# EAGLE schematic SkinOS_Zara_v2 (EAGLE 7.5.0)

## Sheet 1 of 2
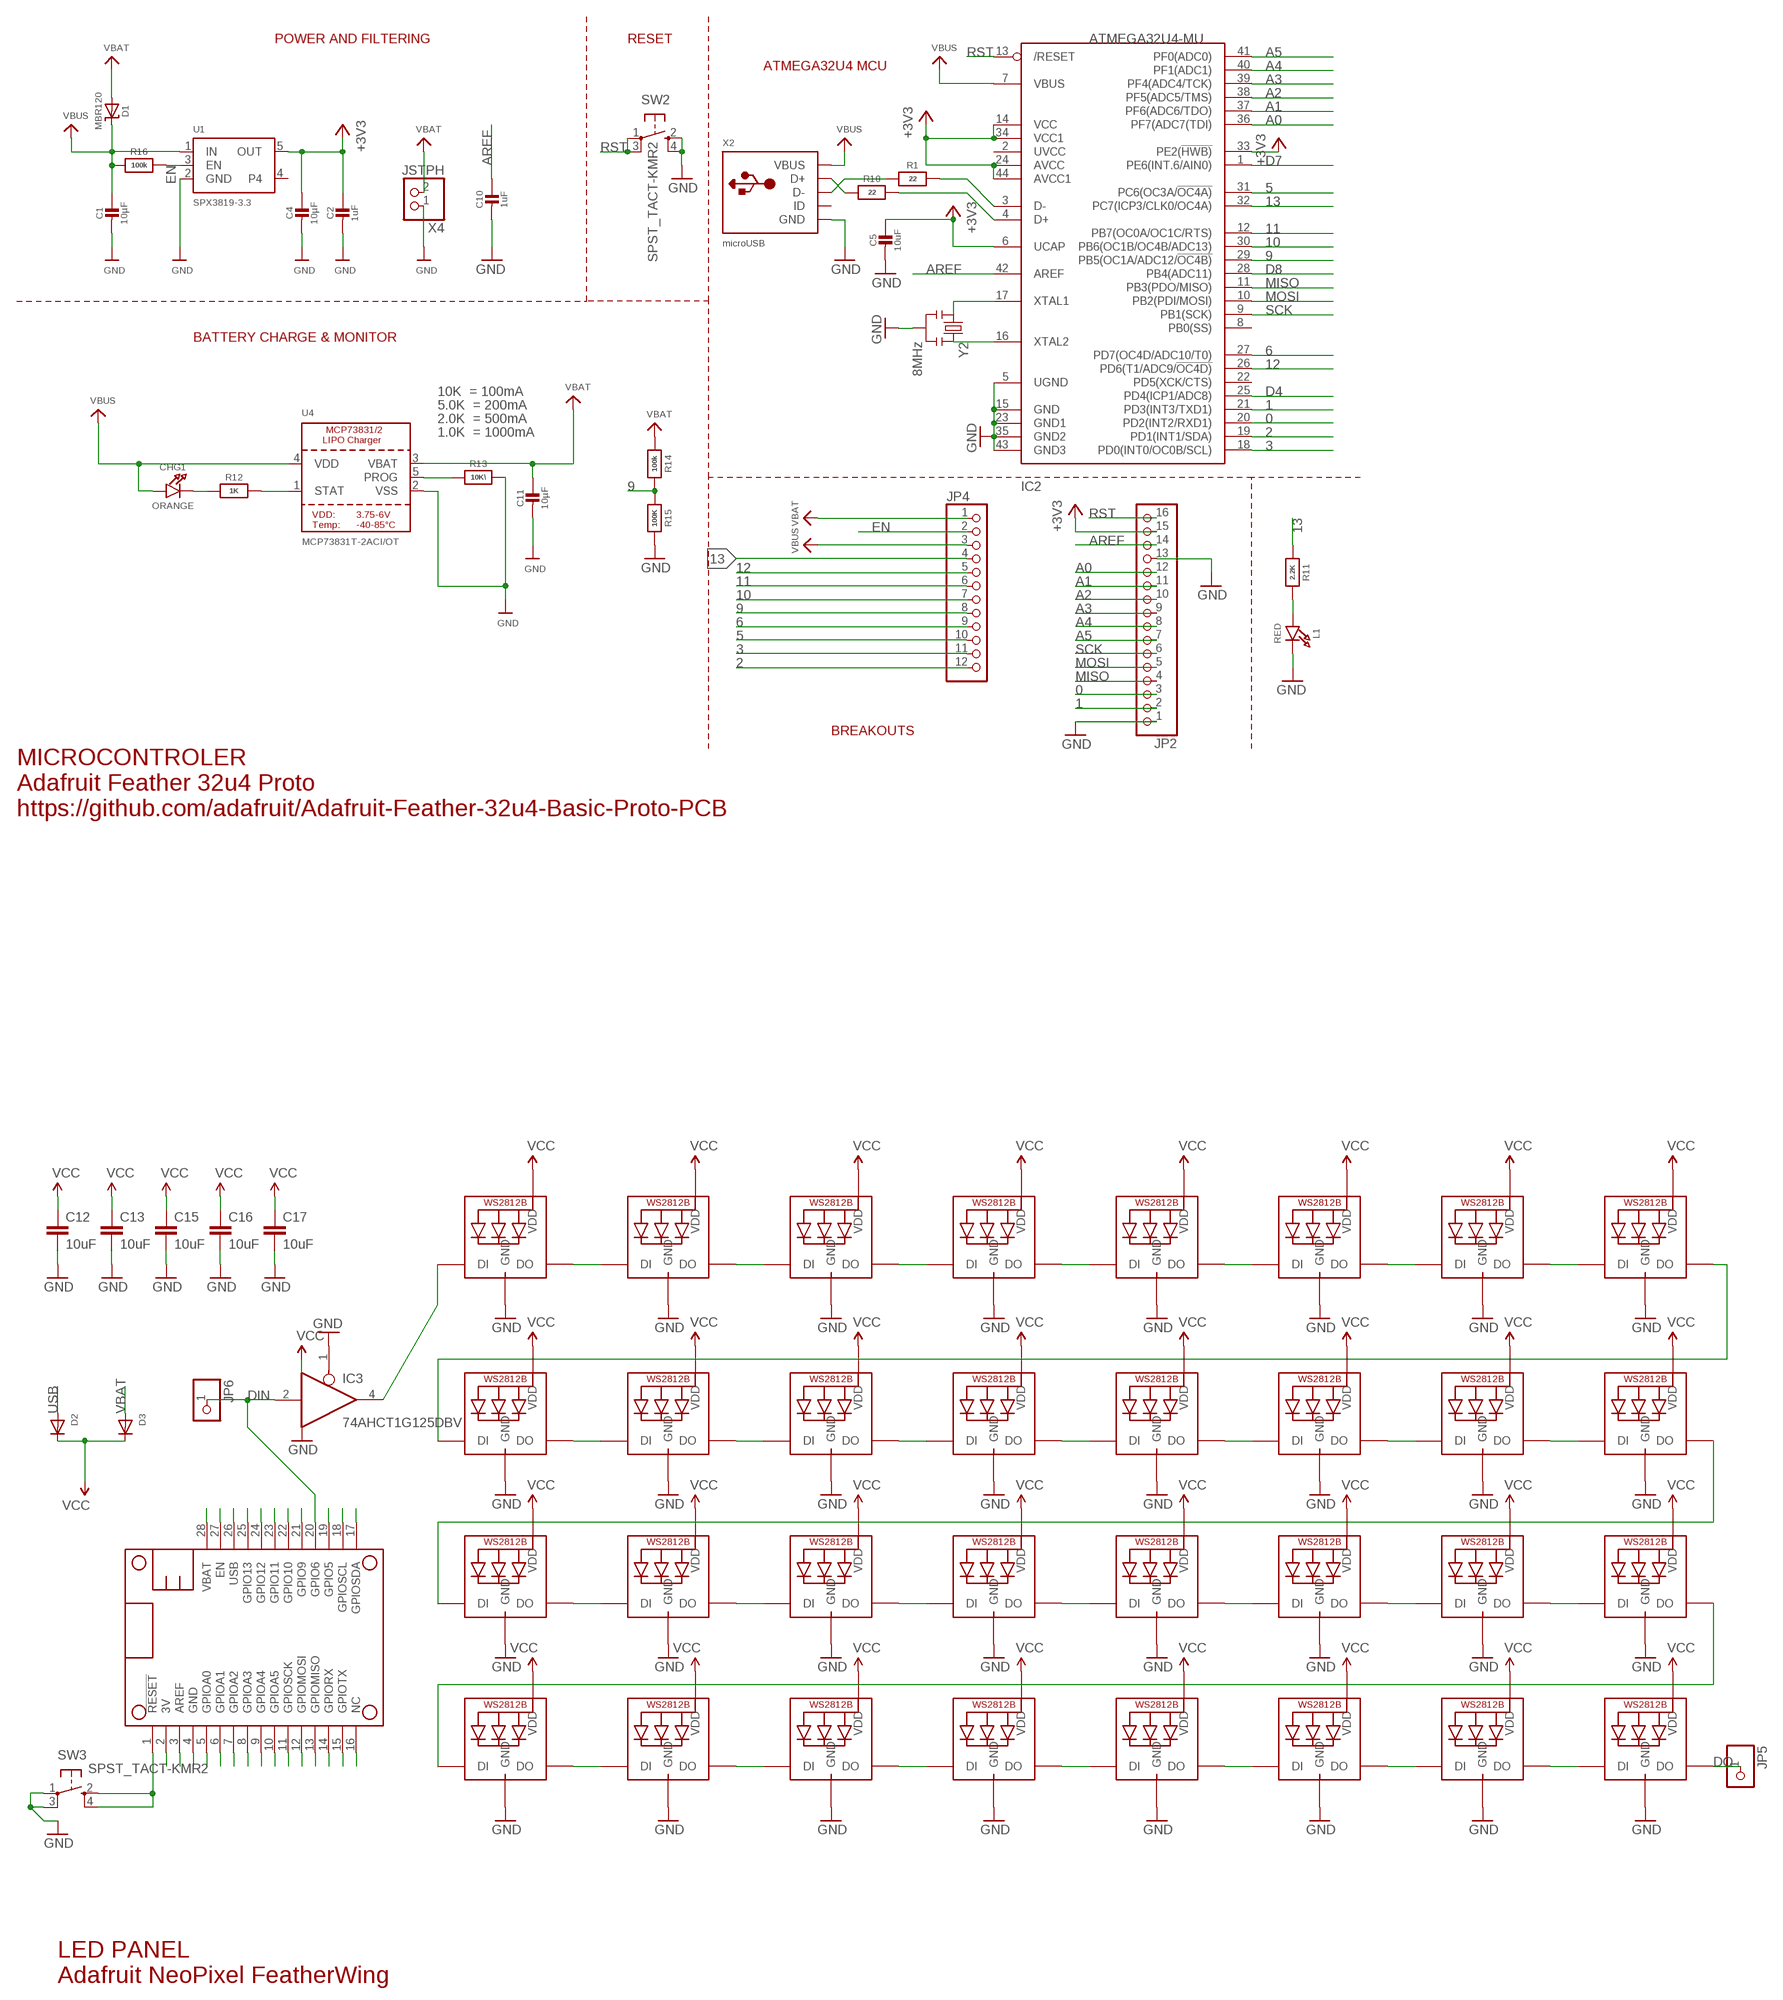
[diagram p0: schematic, sheet 1, part 1 of 2]
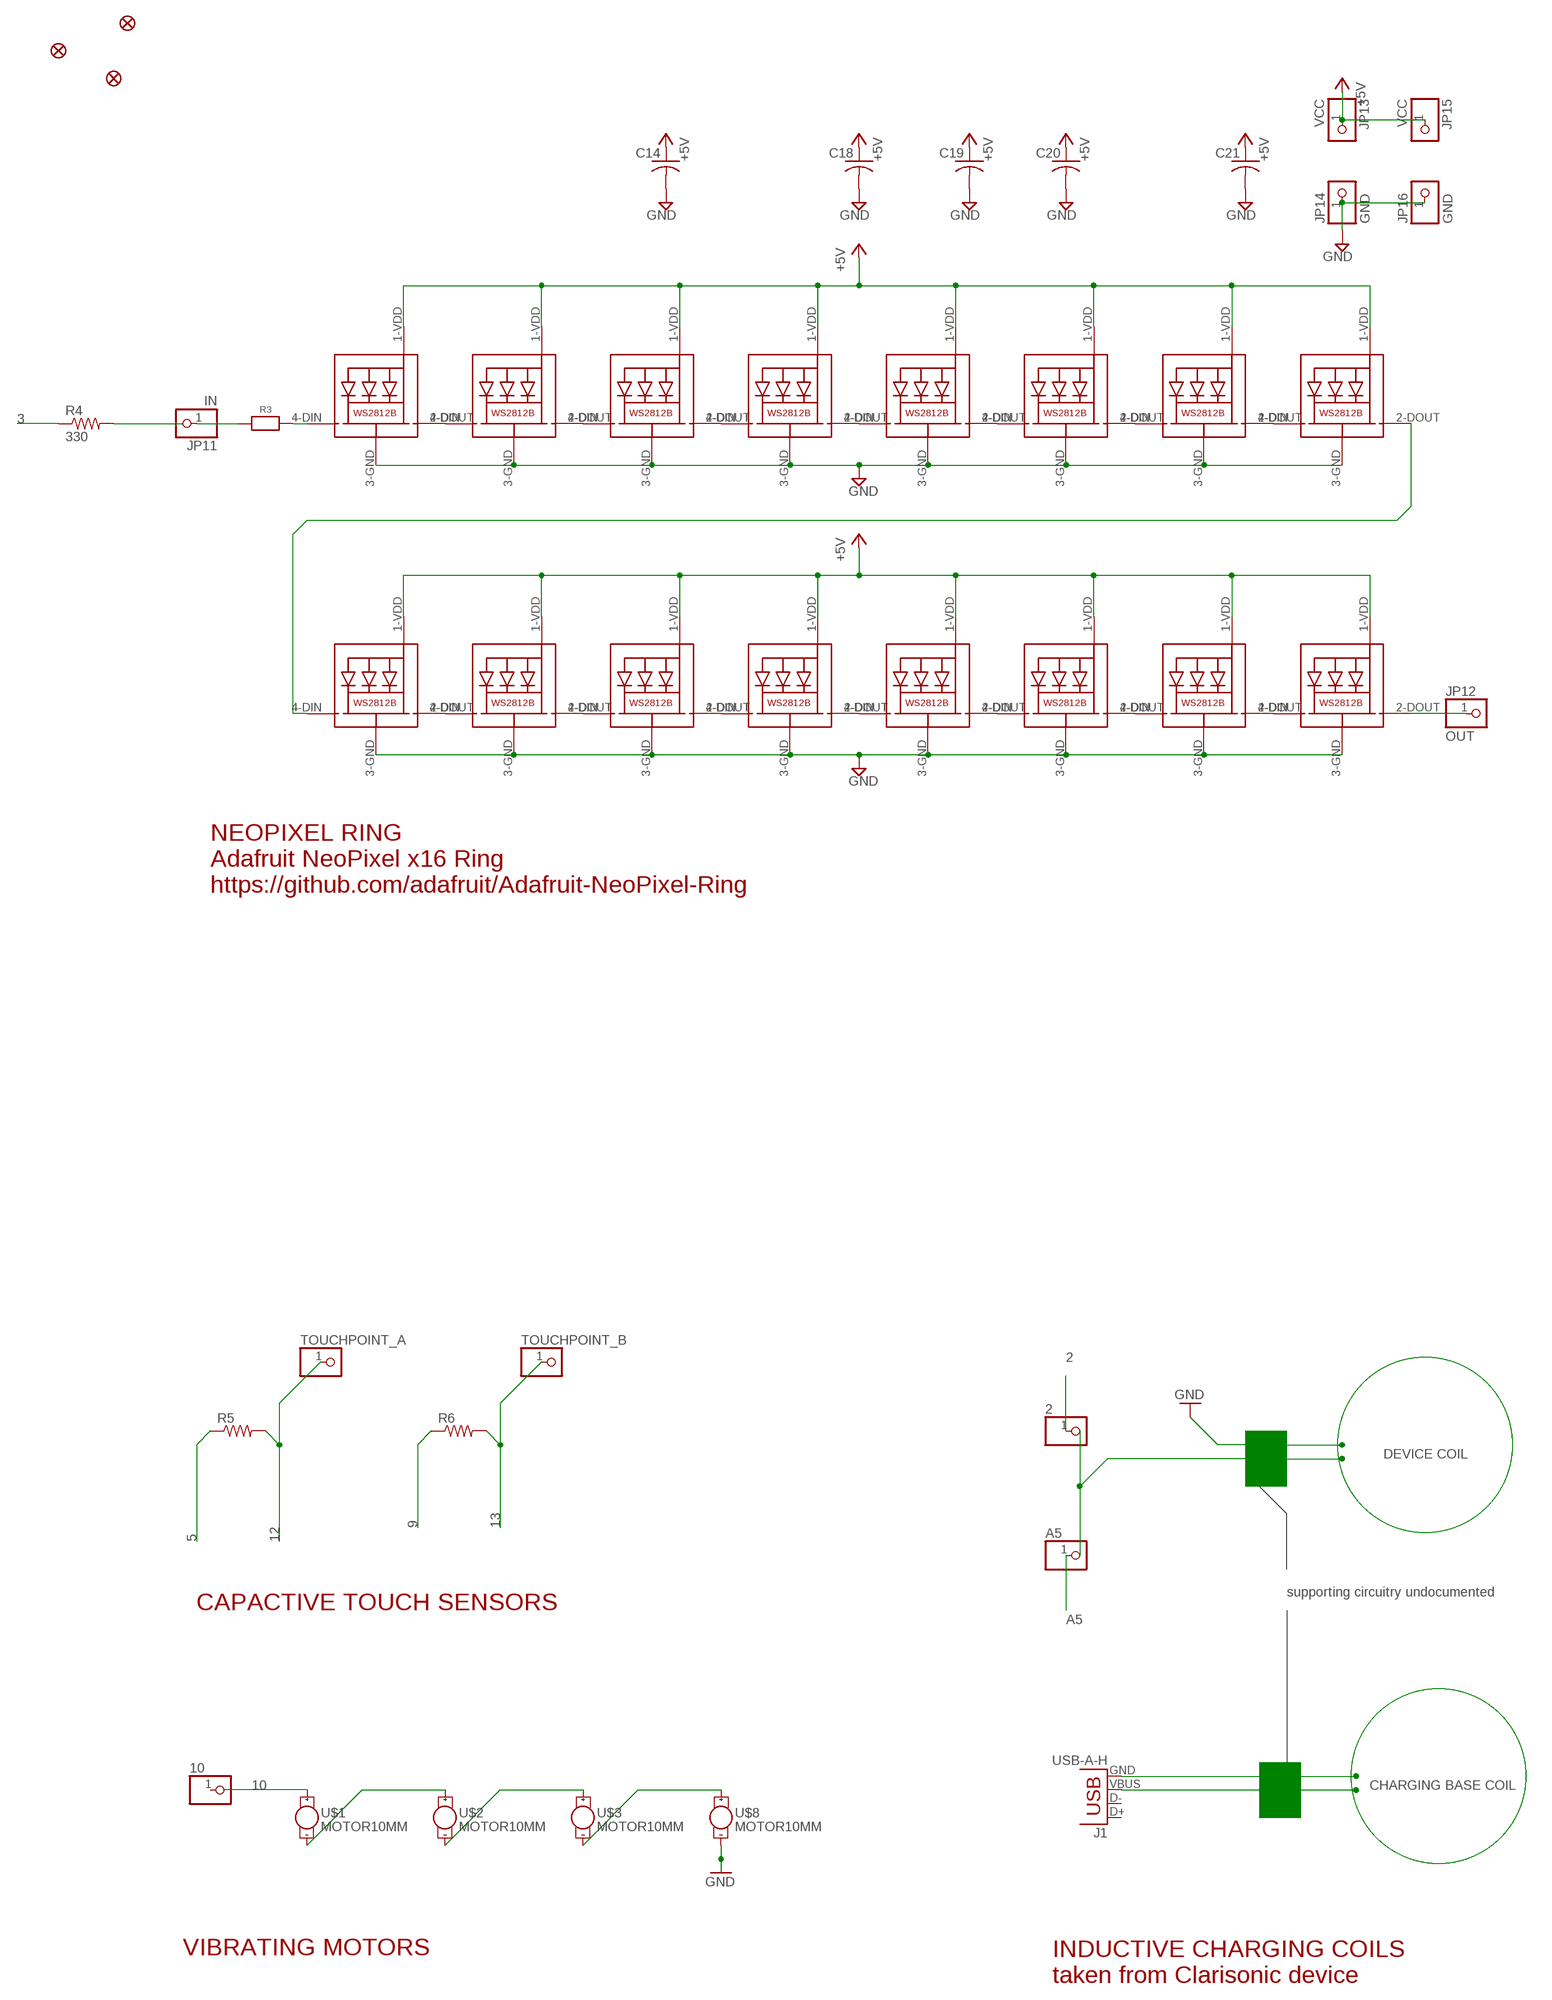
[diagram p1: schematic, sheet 1, part 2 of 2]

### Parts
2  PINHD-1X1  [1X01]
10  PINHD-1X1  [1X01]
A5  PINHD-1X1  [1X01]
C1  10µF  CAP_CERAMIC0805-NOOUTLINE  [0805-NO]
C2  1uF  CAP_CERAMIC0603_NO  [0603-NO]
C4  10µF  CAP_CERAMIC0805-NOOUTLINE  [0805-NO]
C5  10uF  CAP_CERAMIC0805-NOOUTLINE  [0805-NO]
C10  1uF  CAP_CERAMIC0603_NO  [0603-NO]
C11  10µF  CAP_CERAMIC0805-NOOUTLINE  [0805-NO]
C12  10uF  CAP0402-CAP  [0402-CAP]
C13  10uF  CAP0402-CAP  [0402-CAP]
C14  C-USC0603K  [C0603K]
C15  10uF  CAP0402-CAP  [0402-CAP]
C16  10uF  CAP0402-CAP  [0402-CAP]
C17  10uF  CAP0402-CAP  [0402-CAP]
C18  C-USC0603K  [C0603K]
C19  C-USC0603K  [C0603K]
C20  C-USC0603K  [C0603K]
C21  C-USC0603K  [C0603K]
CHG1  ORANGE  LED0805_NOOUTLINE  [CHIPLED_0805_NOOUTLINE]
D1  MBR120  DIODE-SCHOTTKYSOD-123  [SOD-123]
D2  DIODE_SOD-123FL  [SOD-123FL]
D3  DIODE_SOD-123FL  [SOD-123FL]
FID4  FIDUCIAL""  [FIDUCIAL_1MM]
FID5  FIDUCIAL""  [FIDUCIAL_1MM]
FID6  FIDUCIAL""  [FIDUCIAL_1MM]
IC2  ATMEGA32U4-MU  [TQFN44_7MM]
IC3  74AHCT1G125DBV  [SOT23-5]
J1  USB-A-H  [USB-A-H]
JP2  HEADER-1X16ROUND  [1X16_ROUND]
JP4  HEADER-1X12  [1X12_ROUND]
JP5  PINHD-1X1  [1X01]
JP6  PINHD-1X1  [1X01]
JP11  IN  PINHD-1X1CB  [1X01-CLEANBIG]
JP12  OUT  PINHD-1X1CB  [1X01-CLEANBIG]
JP13  VCC  PINHD-1X1CB  [1X01-CLEANBIG]
JP14  GND  PINHD-1X1CB  [1X01-CLEANBIG]
JP15  VCC  PINHD-1X1CB  [1X01-CLEANBIG]
JP16  GND  PINHD-1X1CB  [1X01-CLEANBIG]
L1  RED  LED0805_NOOUTLINE  [CHIPLED_0805_NOOUTLINE]
LED1  WS2812B3535  [LED3535]
LED2  WS2812B3535  [LED3535]
LED3  WS2812B3535  [LED3535]
LED4  WS2812B3535  [LED3535]
LED5  WS2812B3535  [LED3535]
LED6  WS2812B3535  [LED3535]
LED7  WS2812B3535  [LED3535]
LED8  WS2812B3535  [LED3535]
LED9  WS2812B3535  [LED3535]
LED10  WS2812B3535  [LED3535]
LED11  WS2812B3535  [LED3535]
LED12  WS2812B3535  [LED3535]
LED13  WS2812B3535  [LED3535]
LED14  WS2812B3535  [LED3535]
LED15  WS2812B3535  [LED3535]
LED16  WS2812B3535  [LED3535]
LED17  WS2812B3535  [LED3535]
LED18  WS2812B3535  [LED3535]
LED19  WS2812B3535  [LED3535]
LED20  WS2812B3535  [LED3535]
LED21  WS2812B3535  [LED3535]
LED22  WS2812B3535  [LED3535]
LED23  WS2812B3535  [LED3535]
LED24  WS2812B3535  [LED3535]
LED25  WS2812B3535  [LED3535]
LED26  WS2812B3535  [LED3535]
LED27  WS2812B3535  [LED3535]
LED28  WS2812B3535  [LED3535]
LED29  WS2812B3535  [LED3535]
LED30  WS2812B3535  [LED3535]
LED31  WS2812B3535  [LED3535]
LED32  WS2812B3535  [LED3535]
LED49  WS2812B5050  [WS2812B]
LED50  WS2812B5050  [WS2812B]
LED51  WS2812B5050  [WS2812B]
LED52  WS2812B5050  [WS2812B]
LED53  WS2812B5050  [WS2812B]
LED54  WS2812B5050  [WS2812B]
LED55  WS2812B5050  [WS2812B]
LED56  WS2812B5050  [WS2812B]
LED57  WS2812B5050  [WS2812B]
LED58  WS2812B5050  [WS2812B]
LED59  WS2812B5050  [WS2812B]
LED60  WS2812B5050  [WS2812B]
LED61  WS2812B5050  [WS2812B]
LED62  WS2812B5050  [WS2812B]
LED63  WS2812B5050  [WS2812B]
LED64  WS2812B5050  [WS2812B]
MS1  FEATHERWING  [FEATHERWING]
R1  22  RESISTOR_0603_NOOUT  [0603-NO]
R3  RESISTOR_0603_NOOUT  [0603-NO]
R4  330  RESISTOREZ  [AXIAL-0.3EZ]
R5  RESISTOREZ  [AXIAL-0.3EZ]
R6  RESISTOREZ  [AXIAL-0.3EZ]
R10  22  RESISTOR_0603_NOOUT  [0603-NO]
R11  2.2K  RESISTOR_0603_NOOUT  [0603-NO]
R12  1K  RESISTOR_0603_NOOUT  [0603-NO]
R13  10K\  RESISTOR_0603_NOOUT  [0603-NO]
R14  100k  RESISTOR_0603_NOOUT  [0603-NO]
R15  100K  RESISTOR_0603MP  [_0603MP]
R16  100k  RESISTOR_0603_NOOUT  [0603-NO]
SW2  SPST_TACT-KMR2  [KMR2]
SW3  SPST_TACT-KMR2  [KMR2]
TOUCHPOINT_A  PINHD-1X1  [1X01]
TOUCHPOINT_B  PINHD-1X1  [1X01]
U1  SPX3819-3.3  VREG_SOT23-5  [SOT23-5]
U4  MCP73831T-2ACI/OT  MCP73831/2  [SOT23-5]
U$1  MOTOR10MM  [VIBE-MOTOR-10MM]
U$2  MOTOR10MM  [VIBE-MOTOR-10MM]
U$3  MOTOR10MM  [VIBE-MOTOR-10MM]
U$8  MOTOR10MM  [VIBE-MOTOR-10MM]
X2  microUSB  USB_MICRO_20329_V2  [4UCONN_20329_V2]
X4  JSTPH  CON_JST_PH_2PIN  [JSTPH2]
Y2  8MHz  RESONATORSMD  [RESONATOR-SMD]

### Nets
0: IC2.20(PD2(INT2/RXD1)) JP2.3
1: IC2.21(PD3(INT3/TXD1)) JP2.2
2: 2.1 IC2.19(PD1(INT1/SDA)) JP4.12
3: IC2.18(PD0(INT0/OC0B/SCL)) JP4.11 R4.P$1
3V: MS1.2(3V)
5: IC2.31(PC6(OC3A/!OC4A)) JP4.10 R5.P$1
6: IC2.27(PD7(OC4D/ADC10/T0)) JP4.9
9: IC2.29(PB5(OC1A/ADC12/!OC4B)) JP4.8 R6.P$1 R14.2 R15.1
10: IC2.30(PB6(OC1B/OC4B/ADC13)) JP4.7 U$1.+
11: IC2.12(PB7(OC0A/OC1C/RTS)) JP4.6
12: IC2.26(PD6(T1/ADC9/!OC4D)) JP4.5 R5.P$2 TOUCHPOINT_A.1
13: IC2.32(PC7(ICP3/CLK0/OC4A)) JP4.4 MS1.25(GPIO13) R6.P$2 R11.1 TOUCHPOINT_B.1
+3V3: C2.1 C4.1 C5.1 IC2.6(UCAP) IC2.14(VCC) IC2.24(AVCC) IC2.33(PE2(!HWB)) IC2.34(VCC1) IC2.44(AVCC1) JP2.15 U1.5(OUT)
+5V: C14.1 C18.1 C19.1 C20.1 C21.1 ; also sheet 2
A0: IC2.36(PF7(ADC7(TDI)) JP2.12 MS1.5(GPIOA0)
A1: IC2.37(PF6(ADC6/TDO)) JP2.11 MS1.6(GPIOA1)
A2: IC2.38(PF5(ADC5/TMS)) JP2.10 MS1.7(GPIOA2)
A3: IC2.39(PF4(ADC4/TCK)) JP2.9 MS1.8(GPIOA3)
A4: IC2.40(PF1(ADC1)) JP2.8 MS1.9(GPIOA4)
A5: A5.1 IC2.41(PF0(ADC0)) JP2.7 MS1.10(GPIOA5)
AREF: C10.1 IC2.42(AREF) JP2.14 MS1.3(AREF)
D4: IC2.25(PD4(ICP1/ADC8))
D7: IC2.1(PE6(INT.6/AIN0))
D8: IC2.28(PB4(ADC11))
D+1: IC2.4(D+) R10.2
D-1: IC2.3(D-) R1.2
DIN: IC3.2(I) JP6.1 MS1.20(GPIO6)
DO: JP5.1 LED32.3(DO)
EN: JP4.2 MS1.27(EN) R16.2 U1.3(EN)
GND: C1.2 C2.2 C4.2 C5.2 C10.2 C11.2 C12.2 C13.2 C14.2 C15.2 C16.2 C17.2 C18.2 C19.2 C20.2 C21.2 IC2.5(UGND) IC2.15(GND) IC2.23(GND1) IC2.35(GND2) IC2.43(GND3) IC3.1(OE) JP2.1 JP2.13 JP14.1 JP16.1 L1.C LED1.4(GND) LED2.4(GND) LED3.4(GND) LED4.4(GND) LED5.4(GND) LED6.4(GND) LED7.4(GND) LED8.4(GND) LED9.4(GND) LED10.4(GND) LED11.4(GND) LED12.4(GND) LED13.4(GND) LED14.4(GND) LED15.4(GND) LED16.4(GND) LED17.4(GND) LED18.4(GND) LED19.4(GND) LED20.4(GND) LED21.4(GND) LED22.4(GND) LED23.4(GND) LED24.4(GND) LED25.4(GND) LED26.4(GND) LED27.4(GND) LED28.4(GND) LED29.4(GND) LED30.4(GND) LED31.4(GND) LED32.4(GND) LED49.3-GND(GND) LED50.3-GND(GND) LED51.3-GND(GND) LED52.3-GND(GND) LED53.3-GND(GND) LED54.3-GND(GND) LED55.3-GND(GND) LED56.3-GND(GND) LED57.3-GND(GND) LED58.3-GND(GND) LED59.3-GND(GND) LED60.3-GND(GND) LED61.3-GND(GND) LED62.3-GND(GND) LED63.3-GND(GND) LED64.3-GND(GND) MS1.4(GND) R13.2 R15.2 SW2.2(S) SW2.4(S1) SW3.1(P) SW3.3(P1) U1.2(GND) U4.2(VSS) U$8.- X2.BASE@1(GND) X2.BASE@2(GND) X2.GND X2.SPRT@1(GND) X2.SPRT@2(GND) X2.SPRT@3(GND) X2.SPRT@4(GND) X4.1 Y2.2 ; also sheet 2
IN1: JP11.1 R3.1
MISO: IC2.11(PB3(PDO/MISO)) JP2.4 MS1.13(GPIOMISO)
MOSI: IC2.10(PB2(PDI/MOSI)) JP2.5 MS1.12(GPIOMOSI)
N$1: R4.P$2
N$2: U$1.- U$2.+
N$3: U$2.- U$3.+
N$4: U$3.- U$8.+
N$5: IC2.16(XTAL2) Y2.3
N$6: IC2.17(XTAL1) Y2.1
N$7: R10.1 X2.D+
N$8: R1.1 X2.D-
N$9: L1.A R11.2
N$10: CHG1.C R12.1
N$12: J1.VBUS
N$13: R12.2 U4.1(STAT)
N$14: R13.1 U4.5(PROG)
N$15: J1.GND
N$17: LED1.3(DO) LED2.1(DI)
N$18: LED2.3(DO) LED3.1(DI)
N$19: LED3.3(DO) LED4.1(DI)
N$20: LED4.3(DO) LED5.1(DI)
N$21: LED5.3(DO) LED6.1(DI)
N$22: LED6.3(DO) LED7.1(DI)
N$23: LED7.3(DO) LED8.1(DI)
N$24: LED9.3(DO) LED10.1(DI)
N$25: LED10.3(DO) LED11.1(DI)
N$26: LED17.3(DO) LED18.1(DI)
N$27: LED18.3(DO) LED19.1(DI)
N$28: LED11.3(DO) LED12.1(DI)
N$29: LED12.3(DO) LED13.1(DI)
N$30: LED13.3(DO) LED14.1(DI)
N$31: LED19.3(DO) LED20.1(DI)
N$32: LED20.3(DO) LED21.1(DI)
N$33: LED21.3(DO) LED22.1(DI)
N$34: LED14.3(DO) LED15.1(DI)
N$35: LED15.3(DO) LED16.1(DI)
N$36: LED22.3(DO) LED23.1(DI)
N$37: LED23.3(DO) LED24.1(DI)
N$38: LED31.3(DO) LED32.1(DI)
N$39: LED30.3(DO) LED31.1(DI)
N$40: LED29.3(DO) LED30.1(DI)
N$41: LED28.3(DO) LED29.1(DI)
N$42: LED27.3(DO) LED28.1(DI)
N$43: LED26.3(DO) LED27.1(DI)
N$44: LED25.3(DO) LED26.1(DI)
N$45: LED8.3(DO) LED9.1(DI)
N$46: LED16.3(DO) LED17.1(DI)
N$47: LED24.3(DO) LED25.1(DI)
N$48: IC3.4(O) LED1.1(DI)
N$49: MS1.1(!RESET) SW3.2(S) SW3.4(S1)
N$51: MS1.24(GPIO12)
N$52: MS1.23(GPIO11)
N$53: MS1.22(GPIO10)
N$54: MS1.21(GPIO9)
N$55: MS1.19(GPIO5)
N$56: MS1.18(GPIOSCL)
N$57: MS1.17(GPIOSDA)
N$102: LED49.2-DOUT(DO) LED50.4-DIN(DI)
N$103: LED50.2-DOUT(DO) LED51.4-DIN(DI)
N$104: LED51.2-DOUT(DO) LED52.4-DIN(DI)
N$105: LED52.2-DOUT(DO) LED53.4-DIN(DI)
N$106: LED53.2-DOUT(DO) LED54.4-DIN(DI)
N$107: LED54.2-DOUT(DO) LED55.4-DIN(DI)
N$108: LED55.2-DOUT(DO) LED56.4-DIN(DI)
N$109: LED57.2-DOUT(DO) LED58.4-DIN(DI)
N$110: LED58.2-DOUT(DO) LED59.4-DIN(DI)
N$111: LED59.2-DOUT(DO) LED60.4-DIN(DI)
N$112: LED60.2-DOUT(DO) LED61.4-DIN(DI)
N$113: LED61.2-DOUT(DO) LED62.4-DIN(DI)
N$114: LED62.2-DOUT(DO) LED63.4-DIN(DI)
N$115: LED63.2-DOUT(DO) LED64.4-DIN(DI)
N$116: LED56.2-DOUT(DO) LED57.4-DIN(DI)
N$117: LED49.4-DIN(DI) R3.2
NC: MS1.16(NC)
OUT1: JP12.1 LED64.2-DOUT(DO)
RST: IC2.13(/RESET) JP2.16 SW2.1(P) SW2.3(P1)
RX: MS1.14(GPIORX)
SCK: IC2.9(PB1(SCK)) JP2.6 MS1.11(GPIOSCK)
TX: MS1.15(GPIOTX)
USB: D2.A MS1.26(USB)
VBAT: C11.1 D1.A D3.A JP4.1 MS1.28(VBAT) R14.1 U4.3(VBAT) X4.2
VBUS: C1.1 CHG1.A D1.C IC2.7(VBUS) JP4.3 R16.1 U1.1(IN) U4.4(VDD) X2.VBUS
VCC: C12.1 C13.1 C15.1 C16.1 C17.1 D2.C D3.C JP13.1 JP15.1 LED1.2(VDD) LED2.2(VDD) LED3.2(VDD) LED4.2(VDD) LED5.2(VDD) LED6.2(VDD) LED7.2(VDD) LED8.2(VDD) LED9.2(VDD) LED10.2(VDD) LED11.2(VDD) LED12.2(VDD) LED13.2(VDD) LED14.2(VDD) LED15.2(VDD) LED16.2(VDD) LED17.2(VDD) LED18.2(VDD) LED19.2(VDD) LED20.2(VDD) LED21.2(VDD) LED22.2(VDD) LED23.2(VDD) LED24.2(VDD) LED25.2(VDD) LED26.2(VDD) LED27.2(VDD) LED28.2(VDD) LED29.2(VDD) LED30.2(VDD) LED31.2(VDD) LED32.2(VDD) LED49.1-VDD(VDD) LED50.1-VDD(VDD) LED51.1-VDD(VDD) LED52.1-VDD(VDD) LED53.1-VDD(VDD) LED54.1-VDD(VDD) LED55.1-VDD(VDD) LED56.1-VDD(VDD) LED57.1-VDD(VDD) LED58.1-VDD(VDD) LED59.1-VDD(VDD) LED60.1-VDD(VDD) LED61.1-VDD(VDD) LED62.1-VDD(VDD) LED63.1-VDD(VDD) LED64.1-VDD(VDD) ; supply symbol labelled +5V
Unconnected: 10.1 IC2.2(UVCC) IC2.8(PB0(SS)) IC2.22(PD5(XCK/CTS)) J1.D+ J1.D- U1.4 X2.ID

### Notes on the sheet
- POWER AND FILTERING | RESET
- ATMEGA32U4 MCU
- BATTERY CHARGE & MONITOR
- 10K  = 100mA
- 5.0K  = 200mA
- 2.0K  = 500mA
- 1.0K  = 1000mA
- NEOPIXEL RING
  Adafruit NeoPixel x16 Ring
  https://github.com/adafruit/Adafruit-NeoPixel-Ring
- BREAKOUTS
- MICROCONTROLER
  Adafruit Feather 32u4 Proto
  https://github.com/adafruit/Adafruit-Feather-32u4-Basic-Proto-PCB
- DEVICE COIL
- supporting circuitry undocumented
- CAPACTIVE TOUCH SENSORS
- CHARGING BASE COIL
- VIBRATING MOTORS
- INDUCTIVE CHARGING COILS
  taken from Clarisonic device
- LED PANEL
  Adafruit NeoPixel FeatherWing

## Sheet 2 of 2
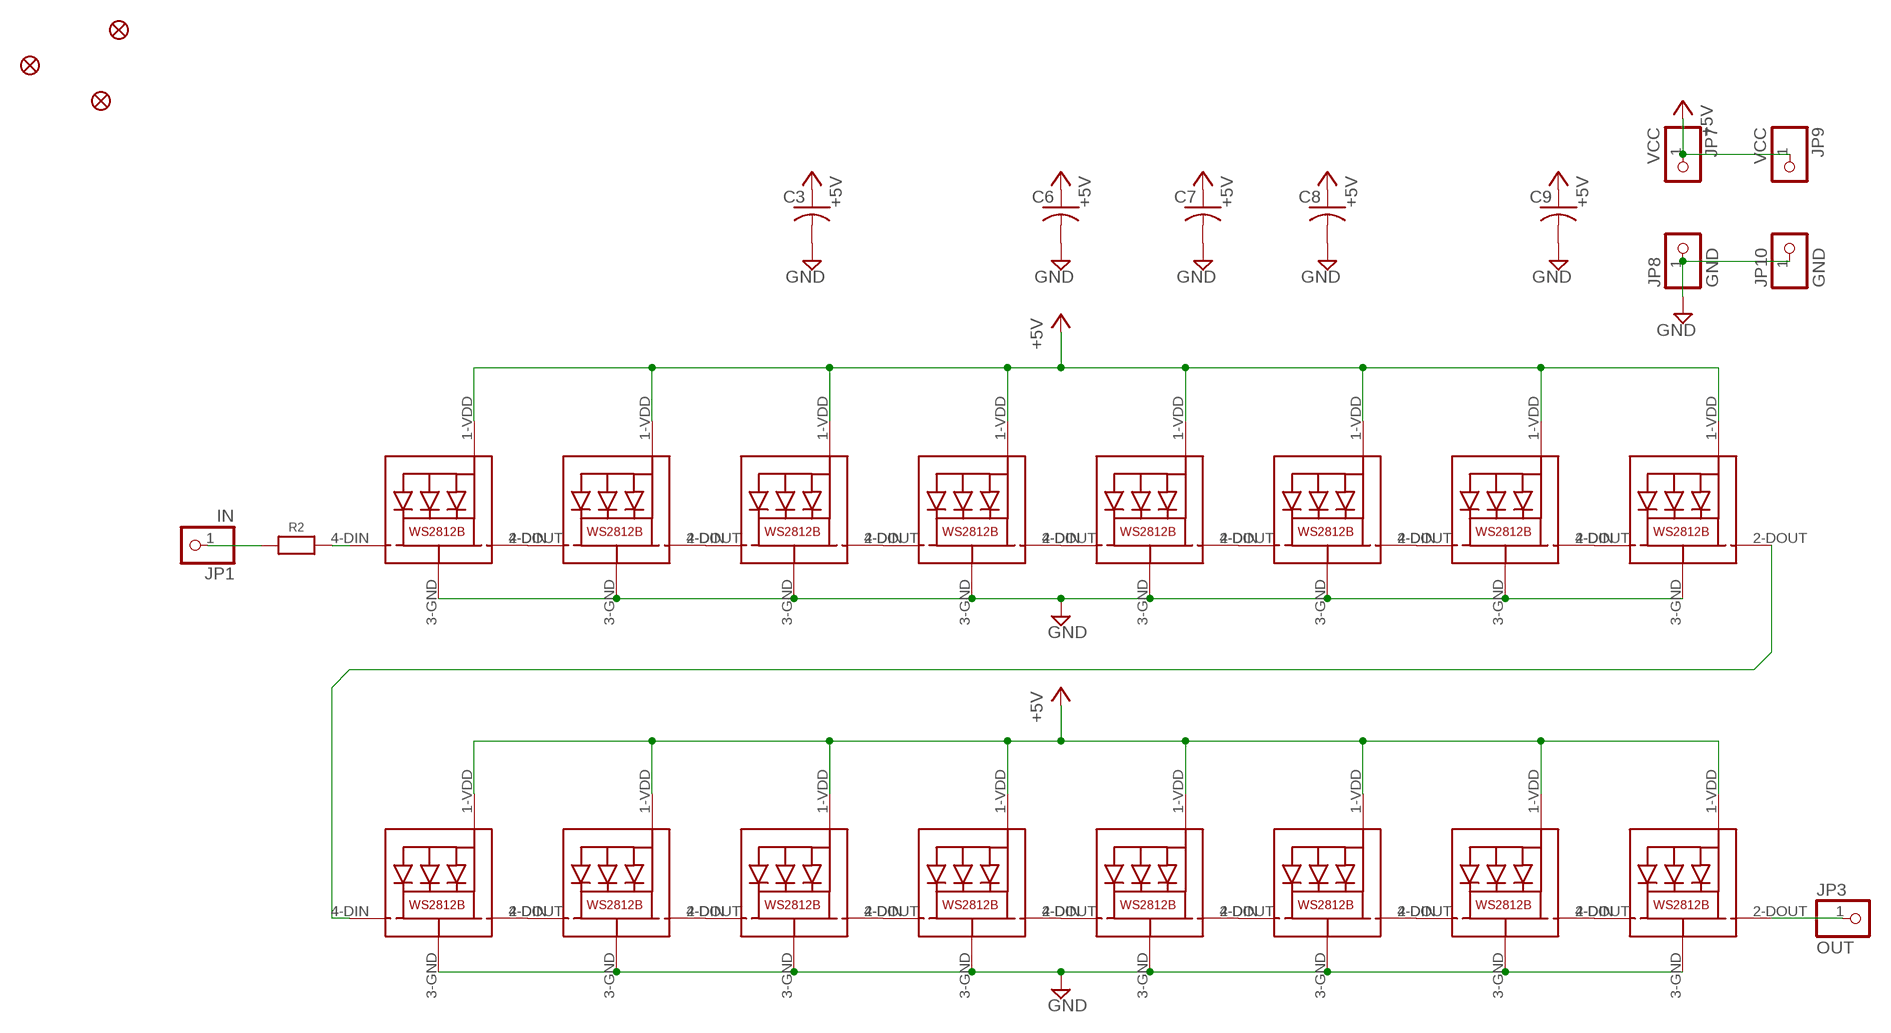
[diagram p2: schematic, sheet 2]

### Parts
C3  C-USC0603K  [C0603K]
C6  C-USC0603K  [C0603K]
C7  C-USC0603K  [C0603K]
C8  C-USC0603K  [C0603K]
C9  C-USC0603K  [C0603K]
FID1  FIDUCIAL""  [FIDUCIAL_1MM]
FID2  FIDUCIAL""  [FIDUCIAL_1MM]
FID3  FIDUCIAL""  [FIDUCIAL_1MM]
JP1  IN  PINHD-1X1CB  [1X01-CLEANBIG]
JP3  OUT  PINHD-1X1CB  [1X01-CLEANBIG]
JP7  VCC  PINHD-1X1CB  [1X01-CLEANBIG]
JP8  GND  PINHD-1X1CB  [1X01-CLEANBIG]
JP9  VCC  PINHD-1X1CB  [1X01-CLEANBIG]
JP10  GND  PINHD-1X1CB  [1X01-CLEANBIG]
LED33  WS2812B5050  [WS2812B]
LED34  WS2812B5050  [WS2812B]
LED35  WS2812B5050  [WS2812B]
LED36  WS2812B5050  [WS2812B]
LED37  WS2812B5050  [WS2812B]
LED38  WS2812B5050  [WS2812B]
LED39  WS2812B5050  [WS2812B]
LED40  WS2812B5050  [WS2812B]
LED41  WS2812B5050  [WS2812B]
LED42  WS2812B5050  [WS2812B]
LED43  WS2812B5050  [WS2812B]
LED44  WS2812B5050  [WS2812B]
LED45  WS2812B5050  [WS2812B]
LED46  WS2812B5050  [WS2812B]
LED47  WS2812B5050  [WS2812B]
LED48  WS2812B5050  [WS2812B]
R2  RESISTOR_0603_NOOUT  [0603-NO]

### Nets
+5V: C3.1 C6.1 C7.1 C8.1 C9.1 JP7.1 JP9.1 LED33.1-VDD(VDD) LED34.1-VDD(VDD) LED35.1-VDD(VDD) LED36.1-VDD(VDD) LED37.1-VDD(VDD) LED38.1-VDD(VDD) LED39.1-VDD(VDD) LED40.1-VDD(VDD) LED41.1-VDD(VDD) LED42.1-VDD(VDD) LED43.1-VDD(VDD) LED44.1-VDD(VDD) LED45.1-VDD(VDD) LED46.1-VDD(VDD) LED47.1-VDD(VDD) LED48.1-VDD(VDD) ; also sheet 1
GND: C3.2 C6.2 C7.2 C8.2 C9.2 JP8.1 JP10.1 LED33.3-GND(GND) LED34.3-GND(GND) LED35.3-GND(GND) LED36.3-GND(GND) LED37.3-GND(GND) LED38.3-GND(GND) LED39.3-GND(GND) LED40.3-GND(GND) LED41.3-GND(GND) LED42.3-GND(GND) LED43.3-GND(GND) LED44.3-GND(GND) LED45.3-GND(GND) LED46.3-GND(GND) LED47.3-GND(GND) LED48.3-GND(GND) ; also sheet 1
IN: JP1.1 R2.1
N$86: LED33.2-DOUT(DO) LED34.4-DIN(DI)
N$87: LED34.2-DOUT(DO) LED35.4-DIN(DI)
N$88: LED35.2-DOUT(DO) LED36.4-DIN(DI)
N$89: LED36.2-DOUT(DO) LED37.4-DIN(DI)
N$90: LED37.2-DOUT(DO) LED38.4-DIN(DI)
N$91: LED38.2-DOUT(DO) LED39.4-DIN(DI)
N$92: LED39.2-DOUT(DO) LED40.4-DIN(DI)
N$93: LED41.2-DOUT(DO) LED42.4-DIN(DI)
N$94: LED42.2-DOUT(DO) LED43.4-DIN(DI)
N$95: LED43.2-DOUT(DO) LED44.4-DIN(DI)
N$96: LED44.2-DOUT(DO) LED45.4-DIN(DI)
N$97: LED45.2-DOUT(DO) LED46.4-DIN(DI)
N$98: LED46.2-DOUT(DO) LED47.4-DIN(DI)
N$99: LED47.2-DOUT(DO) LED48.4-DIN(DI)
N$100: LED40.2-DOUT(DO) LED41.4-DIN(DI)
N$101: LED33.4-DIN(DI) R2.2
OUT: JP3.1 LED48.2-DOUT(DO)

## Power pins joined to a net without a drawn wire
GND: IC3.3(GND)
VCC: IC3.5(VCC)

## Library data of the parts
2 10 A5 JP1 JP3 JP5-JP16 TOUCHPOINT_A TOUCHPOINT_B = adafruit:PINHD-1X1: Pin header 1x1 for 0.1" spacing With round pins
C1 C2 C4 C5 C10 C11 = microbuilder:CAP_CERAMIC: Ceramic Capacitors For new designs, use the packages preceded by an '_' character since they are more reliable: The following footprints should be used on most boards: _0402 - Standard footprint for regular board layouts _0603 - Standard footprint for regular board layouts _0805 - Standard footprint for regular board layouts _1206 - Standard footprint for regular board layouts For extremely tight-pitch boards where space is at a premium, the following 'micro-pitch' footprints can be used (smaller pads, no silkscreen outline, etc.): _0402MP - Micro-pitch footprint for very dense/compact boards _0603MP - Micro-pitch footprint for very dense/compact boards _0805MP - Micro-pitch footprint for very dense/compact boards _1206MP - Micro-pitch footprint for very dense/compact boards
C3 C6-C9 C14 C18-C21 = rcl:C-US: CAPACITOR, American symbol
C12 C13 C15-C17 = SparkFun-Capacitors:CAP: Capacitor Standard 0603 ceramic capacitor, and 0.1" leaded capacitor.
CHG1 L1 = microbuilder:LED: LED 0603 - 0603 Surface Mount Package 2mA: Green LED - Low Power (3.9mcd, 2ma, 1.7Vf) - Digikey: 475-2709-2-ND Orange LED - Low Power (9.8mcd, 2ma, 1.8Vf) - Digikey: 475-1194-2-ND Red LED - Low Power (5mcd, 2ma, 1.8Vf) - Digikey: 475-1195-2-ND Yellow LED - Low Power (7mcd, 2ma, 1.8Vf) - Digikey: 475-1196-2-ND 5mA: Blue LED - Low Power (17mcd, 5ma, 2.9Vf) - Digikey: LNJ937W8CRACT-ND 0805 - 0805 Surface Mount Package 2mA: Red LED (8.8mcd, 2mA, 1.8Vf, Clear) - Low Power [Digikey: 475-2510-1-ND] Green LED (5mcd, 2mA, 1.8Vf, Clear) - Low Power [Digikey: 475-2730-1-ND] Yellow LED (11.3mcd, 2mA, 1.8Vf, Clear) - Low Power [Digikey: 475-2555-1-ND] 20mA: Red LED (104mcd, 20mA, Diffused) - LS R976 [Digikey: 475-1278-6-ND] Red LED (12mcd, 20mA, 2.0Vf, Clear) - APT2012EC [Digikey: 754-1128-1-ND] Green LED (15mcd, 20mA, 2.2Vf, Clear) - APT2012GC [Digikey: 754-1131-1-ND] Orange LED (160mcd, 20mA, 2.1Vf, Clear) - APT2012SECK [Digikey: 754-1130-1-ND] 1206 - 1206 Surface Mount Package Green LED (26mcd, 20mA, Diffused) - LG N971 [Digikey: 475-1407-6-ND] Red LED (15mcd, 20mA, Diffused) - LH N974 [Digikey: 475-1416-6-ND] Cree - Cree High-Power Surface Mount LEDs XPEBWT-L1-0000-00D50 - White 111lm 350mA 2.9Vf 6200K 110° XTEAWT-00-0000-00000LEE3 - White 114lm 350mA 2.85Vf 5000K 115° Everlight - Everlight 45-21 Series Surface Mount LEDs 45-21/QK2C-B2832AC2CB2/2T - Warm White 2000mcd 20mA 3.25Vf 3050K 120° 45-21/LK2C-B38452C4CB2/2T - Nuetral White 2000mcd 20mA 3.25Vf 4150K 120° 45-21/LK2C-B50634C6CB2/2T - Cold White 2200mcd 20mA 3.25Vf 5650K 120° PLCC2 Reverse Mount LS T77K-J1L2-1-0-2-R18-Z - Red 11.25mcd 2mA 1.8Vf 630nm 120° LO T77K-L1M2-24-Z - Orange 19.6mcd 2mA 1.8Vf 606nm 120° LY T77K-K2M1-26-Z - Yellow 15.7mcd 2mA 1.8Vf 587nm 120°
D1 = microbuilder:DIODE-SCHOTTKY
D2 D3 = adafruit:DIODE: Diode SMADIODE - SMA Surface Mount Package 20V 1A Schottky Diode Digikey: 641-1014-6-ND DO-1N4148 - Through Hole Small Current Diode SOD-123 20V 1 A (.5mV Vf) Schottky Diode - Digikey: MBRX120TPMSCT-ND SOD-323 10V 570mA (.38mV Vf, 3ns) Schottky Diode - Digikey: ZLLS410CT-ND SOD-523 30V 30mA Schottky Diode (RB751S-40TE61) - Digikey: RB751S-40TE61CT-ND SOT23-R/W - SOT23 Package (R = Solder Paste/Reflow Ovens, W = Hand-Soldering) BAT54Film 40V 300mA - Digikey: 497-7162-1-ND
FID1-FID6 = microbuilder:FIDUCIAL: Fiducial Alignment Points Various fiducial points for machine vision alignment.; BOM: EXCLUDE
IC2 = microbuilder:ATMEGA32U4: http://www.ladyada.net/library/eagle
IC3 = 74xx-little-us:74*1G125: Single Bus Buffer Gate with 3-State Output
J1 = SparkFun-Connectors:USB: USB Connectors USB-B-PTH is fully proven SKU : PRT-00139/CONN-08278 USB-miniB is fully proven SKU : PRT-00587 USB-A-PCB is untested. USB-A-H is throughly reviewed, but untested. Spark Fun Electronics SKU : PRT-00437 USB-B-SMT is throughly reviewed, but untested. Needs silkscreen touching up. USB-A-S has not been used/tested USB-MB-H has not been used/tested USB-MICROB has been used. CONN-09505; PROD_ID: CONN-08367
JP2 = microbuilder:HEADER-1X16: PIN HEADER
JP4 = microbuilder:HEADER-1X12
LED1-LED32 = adafruit:WS2812B
LED33-LED64 = microbuilder:WS2812B5050
MS1 = adafruit:FEATHERWING
R1-R3 R10-R16 = microbuilder:RESISTOR: Resistors For new designs, use the packages preceded by an '_' character since they are more reliable: The following footprints should be used on most boards: _0402 - Standard footprint for regular board layouts _0603 - Standard footprint for regular board layouts _0805 - Standard footprint for regular board layouts _1206 - Standard footprint for regular board layouts For extremely tight-pitch boards where space is at a premium, the following 'micro-pitch' footprints can be used (smaller pads, no silkscreen outline, etc.): _0402MP - Micro-pitch footprint for very dense/compact boards _0603MP - Micro-pitch footprint for very dense/compact boards _0805MP - Micro-pitch footprint for very dense/compact boards _1206MP - Micro-pitch footprint for very dense/compact boards
R4-R6 = SparkFun-Passives:RESISTOR: Resistor Basic schematic elements and footprints for 0603, 1206, and PTH resistors.
SW2 SW3 = adafruit:SPST_TACT: SMT 6mm switch, EVQQ2 series http://www.ladyada.net/library/eagle
U1 = microbuilder:VREG_SOT23-5: SOT23-5 Fixed Voltage Regulators Part Current Out V Out V In V Dropout θJA (°C/W) TJ (°C) Digikey Part No. ADP121 150mA 3.3V 3.4-5.5V 0.09V @ 150mA -- -- ADP121-AUJZ33R7CT-ND ADP121 150mA 3.0V 3.1-5.5V 0.09V @ 150mA -- -- ADP121-AUJZ30R7CT-ND ADP122 300mA 3.3V 3.4-5.5V 0.085V @ 300mA -- -- ADP122AUJZ-3.3-R7CT-ND ADP1712 300mA 3.3V 3.5-5.5V 0.17V @ 300mA -- -- ADP1712AUJZ-3.3-R7TR-ND AP7311 (Low Cost) 150mA 3.3V 3.5-6V 0.15V @ 150mA -- -- AP7311-33WG-7DICT-ND LD39015M18R 150mA 1.8V 1.9V-5.5V 0.08V @ 100mA -- -- 497-6977-1-ND LP2985A-33DBVR 150mA 3.3V 3.3-16V 0.28V @ 150mA 206 150 296-18479-1-ND MCP1824T-3302E/OT 300mA 3.3V 3.5V-6V 0.2V @ 300mA -- -- MCP1824T-3302E/OTCT-ND MIC5205-2.5YM5 TR 150mA 2.5V 2.7-16V 0.165V @ 150mA -- -- 576-1257-2-ND MIC5205-3.0YM5 TR 150mA 3.0V 3.2V-16V 0.165V @ 150mA -- -- 576-1258-2-ND MIC5205-3.3YM5 TR 150mA 3.3V 3.5V-16V 0.165V @ 150mA -- -- 576-1259-2-ND TPS780330220 150mA 3.3V+2.2V 3.6-5.5V 250mV Max -- -- 296-23332-1-ND TDA3663/N1,135 100mA 3.3V 3.5-45V 0.18V @ 50mA -- -- 568-5343-1-ND Max operating temp can be calculated using θJA, TJ (max junction temperature), and power in watts. Set the "Maximum Ambient Temperature" until it reaches TJ ("Max Junction Temperature"), which is the absolute limit for safe use of the regulator: Heat Sink Temperature Calculator <http://www.daycounter.com/Calculators/Heat-Sink-Temperature-Calculator.phtml> For example, With 12V source into a 3.3V LP2985 and a 30mA load, we are dissipating (12V-3.3V) * 0.03A = 0.261W. With a θJA of 206 °C/W, a TJ of 150°C, and 261mW we can safely use the chip without a heat sink up to 75°C (=147.1°C Junction Temperature).
U4 = microbuilder:MCP73831/2: MCP73831/2 LIPO Charger VDD: 3.75 - 6V Temp -40 - 85°C Programmable Charge Rate: 15-500mA NOTE: STAT is a tri-state logic output on the MCP73831 and an open-drain output on the MCP73832. SOT23-5 with 4.2V output and tri-state logic on STAT = MCP73831T-2ACI/OT
U$1-U$3 U$8 = SparkFun-Electromechanical:MOTOR: Vibration Motor- ROB-08449 Physical dimension and wire connections for this powerful vibration motor. Motor has a self adhesive backing.
X2 = microbuilder:USB: USB Connectors USBMINIB - Surface Mount Female Mini-B USB Connector 4UConnector: 06564
X4 = microbuilder:CON_JST_PH_2PIN: JST 2-Pin Right-Angle Connector PH-Series - 4UConnector: 17311 SH-Series - 4UConnector: 07278
Y2 = SparkFun:RESONATOR: Resonator Small SMD resonator. This is the itty bitty 10/20MHz resonators with built in caps. CSTCE10M0G55 and CSTCE20M0V53. Footprint has been reviewed closely but hasn't been tested yet.